# EAGLE board MainECU rev2 (EAGLE 9.2.2)
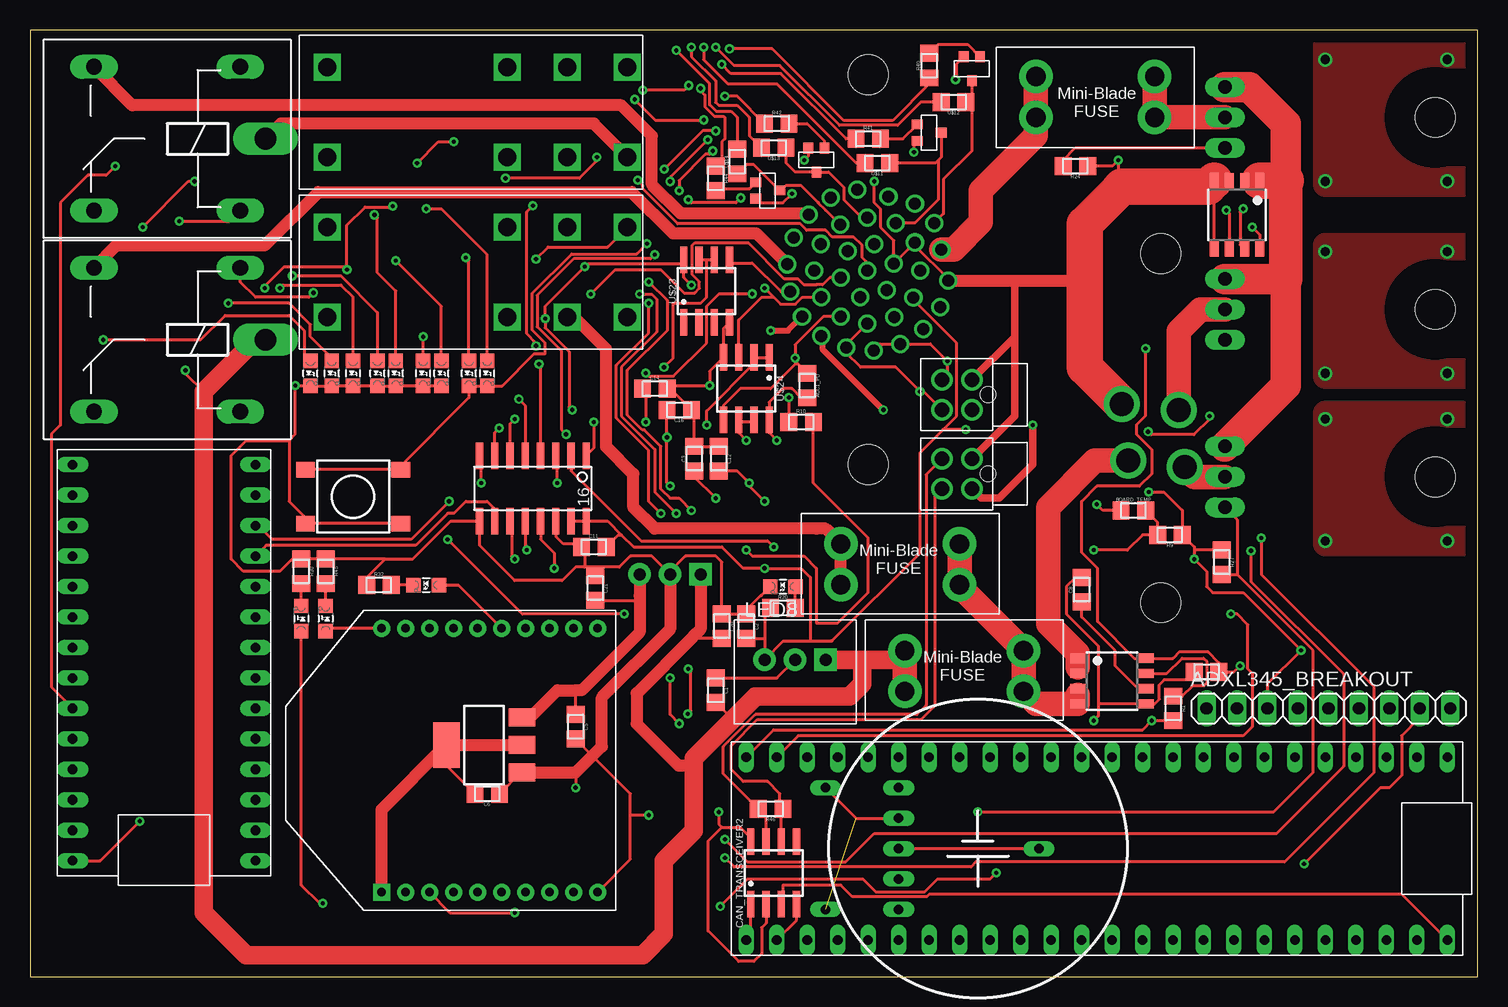
[diagram p2: board, top side]
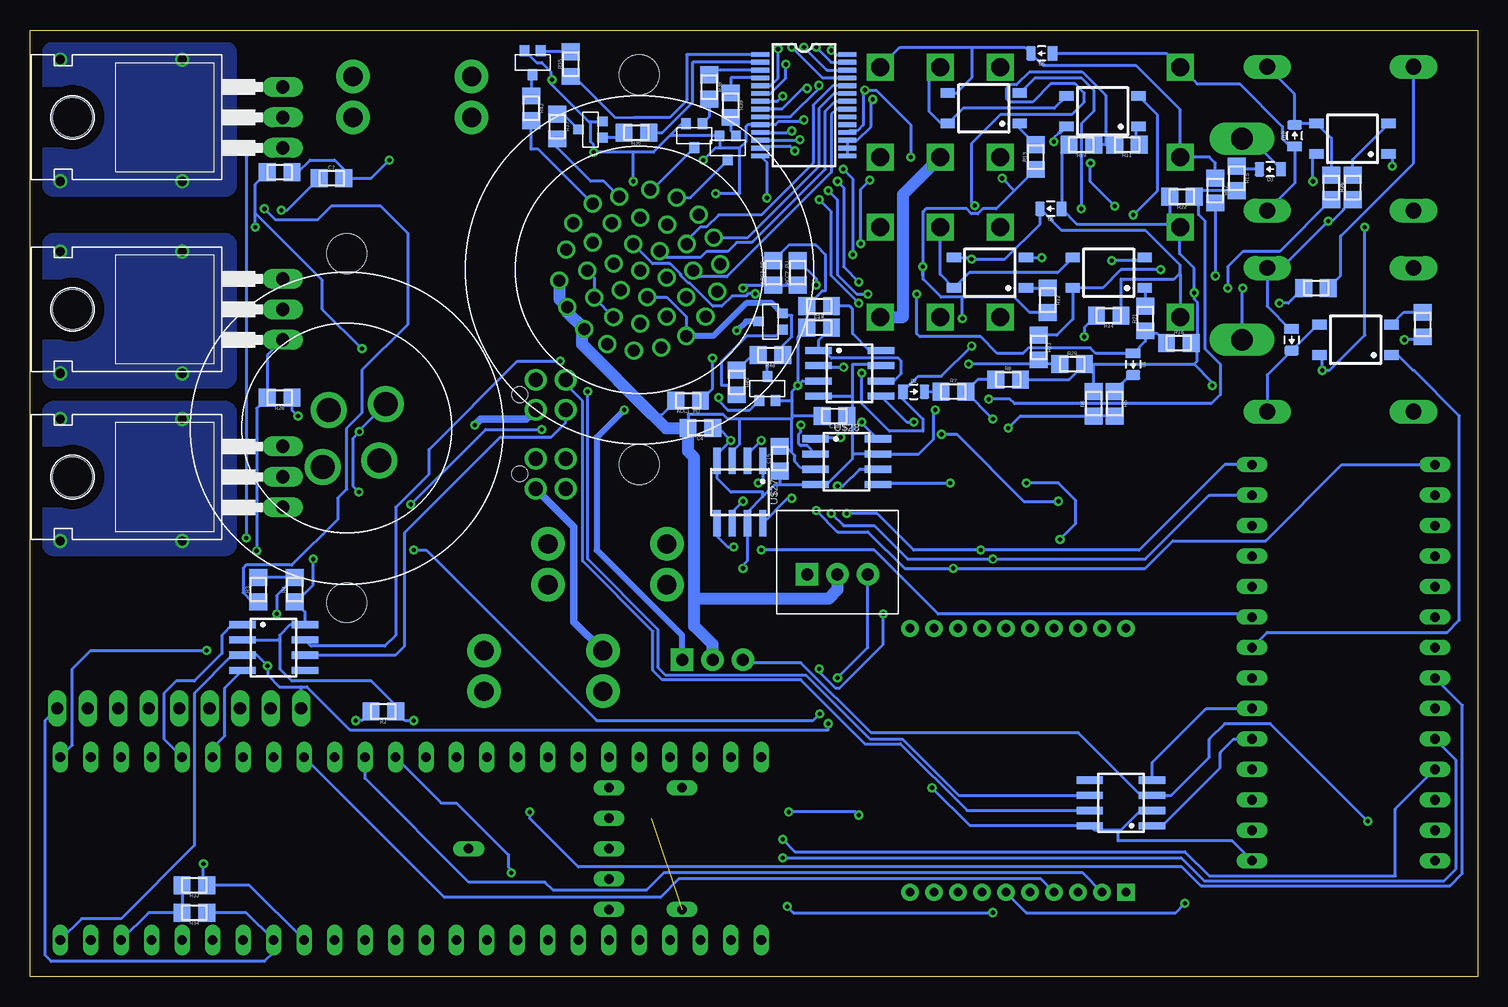
[diagram p3: board, bottom side, seen from below]

Size 120.63 x 78.92 mm. Coordinates in mm from the lower left corner, seen from the top.
Outline: 0,0 120.63,0 120.63,78.92 0,78.92 0,0
Copper layers (1*16): Top 0.035mm / dielectric 1.5mm / Bottom 0.035mm
Design rules "DRC Advanced Circuits": minimum track width 6mil, minimum drill 10mil, track to track 6mil, track to pad 6mil, pad to pad 6mil, via to via 6mil, smd to smd 6mil, copper to edge 40mil, drill to drill 6mil, minimum pad ring 10mil, minimum via ring 8mil, stop-mask expansion 4mil, vias tented up to drill 0mil, thermal gap 10mil

## Footprints (pad centres in the part's own frame; a part is rotated, then mirrored left to right if it is on the bottom)
MINI-BLADE_FUSE_HOLDER = drill 1.613 pad 2.794: L1 0,3.404; L2 0,0; R1 9.906,3.404; R2 9.906,0
0805 = smd 1.4 x 1.5: 1 -1.025,0; 2 1.025,0
1X09 = drill 1.016 long: 1 -8.89,0; 2 -6.35,0; 3 -3.81,0; 4 -1.27,0; 5 1.27,0; 6 3.81,0; 7 6.35,0; 8 8.89,0; 9 11.43,0
SOP04 = smd 0.8 x 1.2: 1 -1.27,-3; 2 1.27,-3; 3 1.27,3; 4 -1.27,3
SOIC-08 = smd 0.6 x 2.2: 1 -1.905,-2.6; 2 -0.635,-2.6; 3 0.635,-2.6; 4 1.905,-2.6; 5 1.905,2.6; 6 0.635,2.6; 7 -0.635,2.6; 8 -1.905,2.6
0805_D = smd 0.8 x 1.2: A -0.9,0; C 0.9,0
G2RL-2 = drill 1.5 square: 2 10.008,0; 3 5.004,0; 4 0,0; 5 0,7.493; 6 5.004,7.493; 7 10.008,7.493; COIL+ 25.019,0; COIL- 25.019,7.493
LED-805 = smd 1.2 x 1.2: A 0,-1.05; C 0,1.05
SOT23 = smd 0.8 x 0.9: 1 -0.675,-1; 2 0.675,-1; 3 0,1
OKI-78SR = drill 1 pad 1.88 square: 1 -2.54,0 | drill 1 pad 1.88: 2 0,0; 3 2.54,0
SOT223 = smd 1.5 x 2.235: 1 -2.3,-3.15; 2 0,-3.15; 3 2.3,-3.15 | smd 3.8 x 2.2: 4 0,3.15
TACTILE_SWITCH_SMD_6.2MM_TALL = smd 1.55 x 1.3: A1 -3.975,-2.25; A2 3.975,-2.25; B1 -3.975,2.25; B2 3.975,2.25
ZF112 = drill 1.321 long: 1 4.064,14.884; 2 4.064,2.896; O 16.256,14.884; S 16.256,2.896 | drill 1.803 long: P 1.956,8.89
TEENSY_3.2_SIMPLE = drill 0.8 long: 3.3V 16.51,29.21; A0 16.51,3.81; A1 16.51,6.35; A2 16.51,8.89; A3 16.51,11.43; A4 16.51,13.97; A5 16.51,16.51; A6 16.51,19.05; A7 16.51,21.59; A8 16.51,24.13; A9 16.51,26.67; AGND 16.51,31.75; D0(RX1) 1.27,31.75; D1(TX1) 1.27,29.21; D2 1.27,26.67; D3(CANTX) 1.27,24.13; D4(CANRX) 1.27,21.59; D5 1.27,19.05; D6 1.27,16.51; D7(RX3) 1.27,13.97; D8(TX3) 1.27,11.43; D9(RX2) 1.27,8.89; D10(TX2) 1.27,6.35; D11 1.27,3.81; D12 1.27,1.27; D13 16.51,1.27; GND 1.27,34.29; VIN 16.51,34.29
TEENSY_3.5_EXT = drill 0.8 long: 3.3V 16.51,54.61; 3.3V_1 1.27,24.13; 3.3V_2 6.35,13.97; A0 16.51,29.21; A1 16.51,31.75; A2 16.51,34.29; A3 16.51,36.83; A4 16.51,39.37; A5 16.51,41.91; A6 16.51,44.45; A7 16.51,46.99; A8 16.51,49.53; A9 16.51,52.07; A12 1.27,3.81; A13 1.27,1.27; A14 16.51,1.27; A15 16.51,3.81; A16 16.51,6.35; A17 16.51,8.89; A18 16.51,11.43; A19 16.51,13.97; A20 16.51,16.51; A21 16.51,19.05; A22 16.51,21.59; AGND 16.51,57.15; D0(RX1) 1.27,57.15; D1(TX1) 1.27,54.61; D2 1.27,52.07; D3(CANTX) 1.27,49.53; D4(CANRX) 1.27,46.99; D5 1.27,44.45; D6 1.27,41.91; D7(RX3) 1.27,39.37; D8(TX3) 1.27,36.83; D9(RX2) 1.27,34.29; D10(TX2) 1.27,31.75; D11 1.27,29.21; D12 1.27,26.67; D13 16.51,26.67; D24 1.27,21.59; D25 1.27,19.05; D26 1.27,16.51; D27 1.27,13.97; D28 1.27,11.43; D29 1.27,8.89; D30 1.27,6.35; GND 1.27,59.69; GND_1 16.51,24.13; GND_2 8.89,13.97; PROG 11.43,13.97; RST 13.97,13.97; VBAT 3.81,13.97; VIN 16.51,59.69
XBEE = drill 0.7 pad 1.422 square: 1 -11,5.5 | drill 0.7 pad 1.422: 2 -11,3.5; 3 -11,1.5; 4 -11,-0.5; 5 -11,-2.5; 6 -11,-4.5; 7 -11,-6.5; 8 -11,-8.5; 9 -11,-10.5; 10 -11,-12.5; 11 11,-12.5; 12 11,-10.5; 13 11,-8.5; 14 11,-6.5; 15 11,-4.5; 16 11,-2.5; 17 11,-0.5; 18 11,1.5; 19 11,3.5; 20 11,5.5
TO-220-H-HOLE = drill 1.118 long: 1 -2.54,-6.35; 2 0,-6.35; 3 2.54,-6.35 | hole 3.302: 0,11.176
SOP8 = smd 0.76 x 1.27: 1 -1.905,-2.86; 2 -0.635,-2.86; 3 0.635,-2.86; 4 1.905,-2.86; 5 1.905,2.86; 6 0.635,2.86; 7 -0.635,2.86; 8 -1.905,2.86
CR-2450/G1AN = drill 0.8 long: +_0 -5.08,12.7; +_1 5.08,12.7; - 0,-5.08
SSOP28 = smd 0.4 x 1.5: 1 -4.225,-3.625; 2 -3.575,-3.625; 3 -2.925,-3.625; 4 -2.275,-3.625; 5 -1.625,-3.625; 6 -0.975,-3.625; 7 -0.325,-3.625; 8 0.325,-3.625; 9 0.975,-3.625; 10 1.625,-3.625; 11 2.275,-3.625; 12 2.925,-3.625; 13 3.575,-3.625; 14 4.225,-3.625; 15 4.225,3.625; 16 3.575,3.625; 17 2.925,3.625; 18 2.275,3.625; 19 1.625,3.625; 20 0.975,3.625; 21 0.325,3.625; 22 -0.325,3.625; 23 -0.975,3.625; 24 -1.625,3.625; 25 -2.275,3.625; 26 -2.925,3.625; 27 -3.575,3.625; 28 -4.225,3.625
SOIC-16 = smd 0.6 x 2.2: 1 -4.445,-2.794; 2 -3.175,-2.794; 3 -1.905,-2.794; 4 -0.635,-2.794; 5 0.635,-2.794; 6 1.905,-2.794; 7 3.175,-2.794; 8 4.445,-2.794; 9 4.445,2.667; 10 3.175,2.667; 11 1.905,2.667; 12 0.635,2.667; 13 -0.635,2.667; 14 -1.905,2.667; 15 -3.175,2.667; 16 -4.445,2.667
AUTOSPORT_14-35 = drill 1: P$1 1.143,6.655; P$2 3.124,5.512; P$3 5.359,4.064; P$4 6.452,2.032; P$5 6.756,-0.254; P$6 6.274,-2.489; P$7 5.08,-4.445; P$8 3.302,-5.893; P$9 1.143,-6.655; P$10 -1.143,-6.655; P$11 -3.302,-5.893; P$12 -5.08,-4.445; P$13 -6.274,-2.489; P$14 -6.756,-0.254; P$15 -6.452,2.032; P$16 -5.359,4.064; P$17 -3.124,5.512; P$18 -1.143,6.655; P$19 1.143,4.369; P$20 3.124,3.023; P$21 4.318,1.016; P$22 4.318,-1.27; P$23 3.124,-3.226; P$24 1.143,-4.369; P$25 -1.143,-4.369; P$26 -3.124,-3.226; P$27 -4.318,-1.27; P$28 -4.318,1.016; P$29 -3.124,3.023; P$30 -1.143,4.369; P$31 1.143,1.88; P$32 2.286,-0.102; P$33 1.143,-2.083; P$34 -1.143,-2.083; P$35 -2.286,-0.102; P$36 -1.143,1.88; P$37 0,-0.102 | hole 3.3: -11.491,-11.491; 11.491,11.491
AUTOSPORT_12-04 = drill 2: P$1 0,3.81; P$2 3.708,0.889; P$3 0,-2.108; P$4 -3.708,0.889 | hole 3.3: -10.288,-10.288; 10.288,10.288
NANO-FIT_VERTICAL-4 = drill 1.2: P$1 -1.25,0; P$2 1.25,0; P$3 -1.25,2.5; P$4 1.25,2.5 | hole 1.3: 0,-1.34

## Placement (x,y rotation side)
5ABOARDFUSE  [MINI-BLADE_FUSE_HOLDER]  82.8,27.18 180 top
5AFUSE  [MINI-BLADE_FUSE_HOLDER]  83.82,71.63 0 top
5ASHUTDOWNFUSE  [MINI-BLADE_FUSE_HOLDER]  77.47,36.07 180 top
ACC1_PD  10k  [0805]  65.79,48.01 180 bottom
ACC1_PU  10k  [0805]  64.77,49.28 270 top
ACC2_PD  10k  [0805]  58.67,58.67 90 bottom
ACC2_PU  10k  [0805]  56.64,58.67 90 bottom
ADXL345_BREAKOUT  [1X09]  106.93,22.35 0 top
BMS_LATCH_SSR  CPC1002N  [SOP04]  41.15,72.39 90 bottom
BMS_SSR  CPC1002N  [SOP04]  31.24,72.14 90 bottom
BOARD_TEMP  THERMISTOR_NCP210805  [0805]  91.95,38.86 0 top
C1  10uF  [0805]  57.15,23.88 270 top
C2  10uF  [0805]  59.69,29.21 270 top
C3  47nF  [0805]  55.37,43.18 90 top
C4  .1uF  [0805]  64.77,45.72 180 bottom
C5  1uF  [0805]  45.47,20.83 270 top
C6  1uF  [0805]  38.1,15.24 180 top
C7  [0805]  95.5,66.55 0 bottom
C8  [0805]  87.63,32.26 90 top
C9  0.1uF  [0805]  98.04,25.4 180 top
C10  0.1uF  [0805]  99.82,67.06 0 bottom
C11  1uF  [0805]  46.99,35.81 0 top
C12  .1uF  [0805]  57.4,43.18 270 top
C14  47nF  [0805]  52.07,49.02 0 top
C15  .1uF  [0805]  58.17,43.18 90 bottom
C16  .1uF  [0805]  54.1,47.24 180 top
C17  47nF  [0805]  54.86,55.88 180 bottom
C18  .1uF  [0805]  53.59,46.74 180 bottom
C19  .1uF  [0805]  54.86,54.1 0 bottom
C20  10uF  [0805]  57.66,29.21 270 top
C21  10uF  [0805]  47.12,32.38 270 top
CAN_TRANSCEIVER  MCP2551  [SOIC-08]  100.33,27.43 270 bottom
CAN_TRANSCEIVER1  MCP2551  [SOIC-08]  29.72,14.48 90 bottom
CAN_TRANSCEIVER2  MCP2551  [SOIC-08]  61.98,8.64 0 top
D1  DIODE0805  [0805_D]  28.7,51.05 270 bottom
D2  DIODE0805  [0805_D]  46.99,48.77 0 bottom
D3  DIODE0805  [0805_D]  17.27,67.31 180 bottom
D4  DIODE0805  [0805_D]  15.49,53.09 270 bottom
D5  DIODE0805  [0805_D]  36.32,76.96 180 bottom
D6  DIODE0805  [0805_D]  35.56,64.01 180 bottom
D10  DIODE0805  [0805_D]  15.24,70.1 90 bottom
IMD_LATCH_SSR  CPC1002N  [SOP04]  40.64,58.67 90 bottom
IMD_SHUTDOWN  G2RL-2-DC12  [G2RL-2]  49.78,62.48 180 top
IMD_SHUTDOWN1  G2RL-2-DC12  [G2RL-2]  49.78,75.82 180 top
IMD_SSR  CPC1002N  [SOP04]  30.73,58.67 90 bottom
INVERTER_SSR  CPC1002N  [SOP04]  10.16,53.09 90 bottom
LED1  White  [LED-805]  36.58,50.29 180 top
LED2  White  [LED-805]  38.1,50.29 180 top
LED3  Green  [LED-805]  30.48,50.29 180 top
LED5  Yellow  [LED-805]  32.77,50.29 180 top
LED6  Red  [LED-805]  23.37,50.29 180 top
LED7  Green  [LED-805]  28.96,50.29 180 top
LED8  Purple  [LED-805]  62.74,32.51 90 top
LED9  Yellow  [LED-805]  34.29,50.29 180 top
LED10  Red  [LED-805]  33.02,32.64 90 top
LED11  Green  [LED-805]  22.61,29.84 0 top
LED14  Blue  [LED-805]  24.64,29.84 0 top
LED17  RED  [LED-805]  26.92,50.29 180 top
LED18  RED  [LED-805]  25.15,50.29 180 top
Q1  MMBT3904LT3G  [SOT23]  78.74,76.2 180 bottom
Q2  MMBT3904LT3G  [SOT23]  73.91,70.61 90 bottom
Q3  MMBT3904LT3G  [SOT23]  65.28,70.1 180 bottom
Q4  MMBT3904LT3G  [SOT23]  62.48,69.09 180 bottom
Q5  MMBT3904LT3G  [SOT23]  78.49,75.69 180 top
Q6  MMBT3904LT3G  [SOT23]  74.93,70.36 270 top
Q7  MMBT3904LT3G  [SOT23]  65.53,68.07 180 top
Q8  MMBT3904LT3G  [SOT23]  61.47,65.53 270 top
Q10  MMBT3904LT3G  [SOT23]  59.18,49.02 0 bottom
R1  1K  [0805]  95.25,22.35 270 top
R2  2K  [0805]  91.19,22.1 180 bottom
R3  1K  [0805]  101.6,32.26 90 bottom
R4  2K  [0805]  98.55,32.26 90 bottom
R5  43k  [0805]  30.23,47.75 270 bottom
R6  12k  [0805]  32,47.75 90 bottom
R7  43k  [0805]  43.69,48.77 0 bottom
R8  12k  [0805]  39.12,49.78 0 bottom
R9  10k  [0805]  95,36.83 180 top
R10  2.2k  [0805]  64.26,46.23 0 top
R11  150  [0805]  29.21,69.34 180 bottom
R12  33  [0805]  35.81,56.39 270 bottom
R13  33  [0805]  36.83,68.33 90 bottom
R14  2k  [0805]  30.73,55.12 180 bottom
R15  43k  [0805]  20.07,66.55 270 bottom
R16  43  [0805]  4.57,54.36 270 bottom
R17  20k  [0805]  21.84,65.53 270 bottom
R18  2.2k  [0805]  24.89,52.83 0 bottom
R19  10k  [0805]  33.02,69.34 180 bottom
R20  270  [0805]  62.74,30.73 0 top
R21  2k  [0805]  27.69,54.86 90 bottom
R22  12k  [0805]  24.64,65.02 180 bottom
R23  43k  [0805]  36.58,52.45 270 bottom
R24  10k  [0805]  87.12,67.56 180 top
R25  330  [0805]  10.41,65.79 90 bottom
R26  1.2K  [0805]  12.19,65.79 270 bottom
R27  10k  [0805]  99.31,34.54 270 top
R28  10k  [0805]  99.82,48.26 180 bottom
R29  12k  [0805]  33.78,51.05 0 bottom
R30  33  [0805]  22.61,33.78 270 top
R31  6.8k  [0805]  13.46,57.4 180 bottom
R32  1.2k  [0805]  29.08,32.64 0 top
R33  4.7k  [0805]  106.93,7.62 180 bottom
R34  4.7k  [0805]  106.93,5.33 180 bottom
R35  2.2k  [0805]  75.56,76.07 90 bottom
R36  2.2k  [0805]  70.1,70.36 180 bottom
R37  0  [0805]  76.71,70.87 270 bottom
R38  2.2k  [0805]  64.01,74.17 270 bottom
R39  2.2k  [0805]  62.23,72.64 270 bottom
R40  2.2k  [0805]  74.93,75.95 90 top
R41  2.2k  [0805]  69.85,69.85 0 top
R42  2.2k  [0805]  62.23,71.12 0 top
R43  0  [0805]  78.87,72.39 270 bottom
R44  2.2k  [0805]  57.15,66.55 270 top
R45  0  [0805]  24.64,33.78 270 top
R46  120  [0805]  61.72,13.97 180 top
R48  10k  [0805]  58.93,51.82 180 bottom
R49  1.2k  [0805]  61.72,49.53 270 bottom
REG  5V  [OKI-78SR]  63.75,26.42 180 top
REG1  TLV1117LV33  [SOT223]  37.85,19.3 90 top
REG3  5V  [OKI-78SR]  53.34,33.53 0 bottom
S1  [TACTILE_SWITCH_SMD_6.2MM_TALL]  26.92,40.01 180 top
SOFTWARE_SHUTOFF  G5LE  [ZF112]  21.59,78.74 180 top
U$1  TEENSY_3.2_SIMPLE  [TEENSY_3.2_SIMPLE]  20.07,43.94 180 top
U$2  TEENSY_3.5_EXT  [TEENSY_3.5_EXT]  58.42,19.56 270 top
U$3  XBEE  [XBEE]  34.8,18.03 90 top
U$4  N-CHANNEL_MOSFET_FQP30N06L  [TO-220-H-HOLE]  105.92,55.63 90 bottom
U$5  CPC1002N  [SOP04]  10.41,69.85 90 bottom
U$6  N-CHANNEL_MOSFET_FQP30N06L  [TO-220-H-HOLE]  105.92,41.66 90 bottom
U$7  N-CHANNEL_MOSFET_FQP30N06L  [TO-220-H-HOLE]  105.92,71.63 90 bottom
U$8  G5LE  [ZF112]  21.59,61.98 180 top
U$9  ACS715_CURRENT_SENSOR  [SOP8]  90.17,24.64 270 top
U$10  ACS715_CURRENT_SENSOR  [SOP8]  100.58,63.5 180 top
U$11  JUMPER  [0805]  70.61,67.82 180 top
U$12  JUMPER  [0805]  76.96,72.9 180 top
U$13  JUMPER  [0805]  61.98,69.09 180 top
U$14  JUMPER  [0805]  58.93,67.94 90 top
U$15  SMMBT2907ALT1G  [SOT23]  58.93,54.61 90 bottom
U$16  CR-2450/G1AN  [CR-2450/G1AN]  78.99,10.67 90 top
U$17  MCP23S17SSOP28  [SSOP28]  56.13,72.64 270 bottom
U$18  MCP3208SOIC  [SOIC-16]  41.91,40.64 180 top
U$23  MCP6002SOIC  [SOIC-08]  56.39,57.15 0 top
U$24  MCP6002SOIC  [SOIC-08]  59.69,49.02 180 top
U$26  [SOIC-08]  52.32,50.29 270 bottom
U$27  [SOIC-08]  61.47,40.39 180 bottom
U$28  [SOIC-08]  52.58,42.93 270 bottom
X1  CONNECTOR-37  [AUTOSPORT_14-35]  69.85,58.93 45 bottom
X2  CONNECTOR-4AUTOSPORT  [AUTOSPORT_12-04]  94.23,45.72 225 bottom
X3  CONNECTOR-4NANO-FIT-VERTICAL-4  [NANO-FIT_VERTICAL-4]  78.49,48.51 90 top
X4  CONNECTOR-4NANO-FIT-VERTICAL-4  [NANO-FIT_VERTICAL-4]  78.49,41.91 90 top

## Tracks (layer width: path | path; a pad name or v marks a point on that pad's centre or on a via)
3.3V
  Bottom 0.254: U$2.3.3V 110.74,5.33 R34.2 R33.2
12VIN
  Top 0.508: 87.31,25.78 U$9.2
  Top 2.032: X2.P$1 88.75,43.03 84.84,39.12 84.84,29.4 87.31,26.92 U$9.1 87.31,25.78
12VSUPPLY_READ  (via drill 0.35)
  Top 0.254: U$18.4 42.55,50.93 v42.42,51.05
  Bottom 0.254: R29.1 36.2,51.05 R23.2 36.95,51.05 v42.42,51.05
12VUNFUSED
  Top 0.508: 87.31,23.5 U$9.3
  Top 2.032: 5ASHUTDOWNFUSE.L2 5ASHUTDOWNFUSE.L1 77.47,32.51 79.76,30.23 5ABOARDFUSE.L2 5ABOARDFUSE.L1 83.84,22.73 U$9.4 87.31,23.5
+5V  (via drill 0.35, 0.35 pad 0.55)
  Top 0.254: 65.02,27.94 66.7,27.94 66.73,27.96 66.83,27.96 74.17,35.31 74.17,43.69 76.1,45.62 | 65.02,27.94 62.74,27.94 REG.3 61.21,28.19 | U$18.15 U$18.16 48.13,37.97 49.28,36.83 | 76.1,45.62 77.22,46.74 77.22,52.83 73.62,56.43 X1.P$28 | R20.1 61.21,30.23 61.21,28.19 | C2.2 61.2,28.18 61.21,28.19 | v62.23,44.7 61.59,45.34 U$24.8 61.59,47.88 62.74,49.02 63.5,49.02 64.27,48.25 ACC1_PU.2 | 49.28,36.83 50.29,35.81 57.66,35.81 59.44,34.04 v61.21,34.04 64.26,34.04 65.02,33.27 65.02,27.94 | v51.05,73.91 54.51,73.91 v54.89,74.3 | v45.19,47.24 44.94,47.5 44.94,52.09 42.93,54.1 v42.93,54.86 42.93,55.88 v46.23,59.18 46.48,59.44 54.17,59.44 U$23.8 54.48,58.29 v55.12,57.66 | v47.24,68.33 47.2,68.28 47.2,67.97 45.77,66.55 v39.62,66.55 | BOARD_TEMP.1 89.41,38.86 v88.9,39.37 | v77.98,45.62 76.1,45.62 | C11.2 49.03,36.83 49.28,36.83 | U$1.VIN 5.84,9.65 v9.14,12.95
  Bottom 0.254: 38.6,65.53 40.12,64.01 41.23,64.01 41.64,63.6 42.18,63.6 42.59,64.01 45.97,64.01 46.2,63.78 46.2,58.42 | 42.93,56.64 38.61,56.64 37.34,55.37 35.82,55.37 R12.2 | 42.93,56.64 44.7,56.64 46.2,58.14 46.2,58.42 | v61.21,34.04 61.21,34.29 60.83,34.67 U$27.7 60.83,38.73 59.56,40.01 | 59.56,40.01 59.56,40.39 62.23,40.39 63.37,41.53 U$27.4 63.37,43.56 v62.23,44.7 63.25,45.72 C4.1 | 58.17,41.02 58.55,41.02 59.56,40.01 | 58.17,41.02 U$28.4 54.23,41.02 52.07,43.18 52.07,43.69 | U$26.4 52.07,48.39 | 52.07,48.39 52.07,51.05 49.85,51.05 U$26.7 | 52.07,46.48 52.07,48.39 | 52.07,46.48 52.31,46.48 C18.1 | 52.07,43.69 52.07,46.48 | 52.07,43.69 51.94,43.56 U$28.7 46.59,43.56 45.33,44.82 45.33,47.24 v45.19,47.24 | C15.1 58.17,41.02 | U$17.18 52.34,70.54 51.64,70.54 51.18,71 51.18,73.79 v51.05,73.91 50.12,73.91 47.24,71.03 v47.24,68.33 | U$17.9 57.26,71.67 54.89,74.04 v54.89,74.3 | v39.62,66.55 38.6,65.53 | R13.1 38.6,65.53 | ACC2_PU.2 55.12,58.17 v55.12,57.66 | v88.9,39.37 82.65,45.62 v77.98,45.62 | REG.3 60.96,26.16 56.39,26.16 50.55,20.32 33.27,20.32 28.07,15.11 CAN_TRANSCEIVER1.3 25.53,15.11 22.35,18.29 22.35,19.81 21.08,21.08 17.27,21.08 v9.14,12.95 | 46.2,58.42 46.23,58.45 v46.23,59.18 | v42.93,54.86 42.93,56.64 | X1.P$29 73.62,58.28 X1.P$28 X1.P$27
+12V  (via drill 0.35, 0.35 pad 0.55)
  Top 0.254: v12.95,50.55 12.95,50.29 14.48,48.77 | v9.4,62.48 13.21,66.29 v13.72,66.29 | v32.26,67.82 34.04,69.6 v35.31,69.6 | v19.56,57.4 19.56,57.57 21.17,59.18 26.42,59.18 v26.42,58.93 26.42,62.65 27.92,64.16 30.14,64.16 v30.23,64.24 | C20.2 55.38,28.18 55.24,28.32 | C1.2 58.56,21.44 58.57,21.44
  Top 0.508: X1.P$10 66.04,53.33 66.04,52.32 v71.12,47.24
  Top 0.61: v83.57,45.97 83.57,42.67 81.03,40.13 80.77,39.88 79.27,39.88 X4.P$1
  Top 1.016: REG3.1 55.88,28.96 55.24,28.32 50.55,23.62 50.55,21.08 54.03,17.59 55.19,17.59 55.31,17.72
  Top 1.524: 5ABOARDFUSE.R2 72.14,26.42 69.34,26.42 | 69.34,26.42 REG.1 | U$8.P 18.8,53.09 14.48,48.77 14.48,5.33 18.03,1.78 51.05,1.78 52.83,3.56 52.83,9.65 55.31,12.13 55.31,17.72 55.31,18.18 58.57,21.44 60.44,23.31 60.44,23.37 68.33,23.37 69.34,24.38 69.34,26.42
  Top 2.032: 5ABOARDFUSE.R2 5ABOARDFUSE.R1
  Bottom 0.254: R23.1 35.05,53.48 33.73,54.79 IMD_SSR.4 31.24,57.4 29.72,58.93 v26.42,58.93 | v13.72,66.29 13.72,68.28 U$5.4 | v30.23,64.24 32.26,66.27 v32.26,67.82 | BMS_SSR.4 34.74,70.37 34.86,70.37 35.31,69.93 v35.31,69.6 | INVERTER_SSR.4 12.95,51.61 v12.95,50.55 12.32,50.55 9.4,53.47 v9.4,62.48 | R48.1 57.9,52.59 57.15,53.34 57.15,55.12 57.76,55.12 U$15.2 | v19.56,57.4 19.63,57.33 U$8.P | X1.P$34 67.57,56.65 65.95,55.03 X1.P$10
  Bottom 0.508: REG.1 66.29,28.45 73.41,35.56 73.41,44.96 v71.12,47.24 | U$15.2 58.78,56.13 60.96,56.13 63.68,53.41 X1.P$10
  Bottom 0.61: X4.P$1 75.3,37.48 75.3,29.58 5ABOARDFUSE.R2 | v83.57,45.97 83.06,46.48 79.27,46.48 X3.P$1
BMS_COIL_PWR
  Bottom 0.254: BMS_LATCH_SSR.3 43.43,73.66 42.16,74.93 42.16,77.47 | IMD_SHUTDOWN1.4 48.13,77.47 42.16,77.47 | 42.16,77.47 37.73,77.47 D5.C 36.21,75.95 28.45,75.95 24.77,72.26 IMD_SHUTDOWN1.COIL- 22.34,68.33 21.84,67.83 R17.1
BMS_OK  (via drill 0.35, 0.35 pad 0.55)
  Top 0.254: v41.91,64.26 41.4,63.75 41.4,53.59 42.16,52.83 v42.16,52.58 | v51.31,50.3 51.56,50.05 53.61,50.05 56.39,52.83 56.39,55.88 57.43,56.92 v60.2,56.92
  Bottom 0.254: v42.16,52.58 44.69,50.05 46.61,50.05 D2.A 47.89,48.14 46.23,46.48 46.23,45.47 49.02,45.47 51.31,47.75 v51.31,50.3 | 30.99,69.34 30.99,73.47 32.95,75.44 37.34,75.44 38.44,74.34 38.99,74.34 39.24,74.09 39.24,73.15 38.99,72.9 37.08,72.9 35.56,74.42 33.53,74.42 32.77,73.66 32.77,72.9 33.78,71.88 39.75,71.88 42.16,69.47 42.16,64.52 v41.91,64.26 | 30.99,69.34 R19.1 | R11.2 30.99,69.34 | v60.2,56.92 60.77,56.92 60.94,56.75 62.13,56.75 62.99,55.88 63.72,55.88 65.67,57.82 65.79,57.82 66.39,58.43 66.39,58.55 67.28,59.44 68.74,59.44 X1.P$31
BMS_OK_READ  (via drill 0.35 pad 0.55)
  Top 0.254: U$18.6 40.01,46.1 v40.39,46.48
  Bottom 0.254: R8.1 41.65,49.78 R7.2 v40.39,46.48
BMS_PWR_STEP
  Bottom 0.254: BMS_SSR.3 35.26,72.39 42.88,72.39 BMS_LATCH_SSR.4 44.7,71.12 45.72,72.14 45.72,74.88 IMD_SHUTDOWN1.3
BRAKE_LIGHT  (via drill 0.35)
  Top 0.508: v61.72,53.85 63.15,53.85 X1.P$9
  Bottom 0.508: U$15.3 60.96,54.61 v61.72,53.85
BRAKE_LIGHT_CTRL  (via drill 0.35)
  Top 0.254: v59.69,35.56 60.2,35.05 64.52,35.05 65.53,34.04 65.53,29.46 67.31,29.46 69.85,32 69.85,36.58 65.28,41.15 65.28,46.22 R10.2
  Bottom 0.254: U$1.D7(RX3) 19.05,30.23 44.96,30.23 50.29,35.56 v59.69,35.56
CANH  (via drill 0.35)
  Top 0.254: X3.P$4 76.45,50.23 v76.45,51.31 75.03,52.73 X1.P$13 70.84,52.73 X1.P$12
  Bottom 0.254: CAN_TRANSCEIVER1.7 42.55,13.84 48.11,19.41 51.05,19.41 56.39,24.74 67.94,24.74 68.73,25.53 68.73,28.79 74.57,34.63 74.57,47.97 75.99,49.38 X3.P$4 | v76.45,51.31 80.01,51.31 87.38,43.94 87.38,41.91 90.17,39.12 90.17,28.45 91.06,27.56 97.22,27.56 CAN_TRANSCEIVER.7
CANL  (via drill 0.35)
  Top 0.254: X3.P$3 74.48,48.77 v74.17,48.77 72.14,50.8 69.22,50.8 68.02,52 X1.P$11 68.02,52.68 X1.P$26
  Bottom 0.254: CAN_TRANSCEIVER.6 90.17,26.8 89.41,27.56 89.41,37.02 81.47,44.96 77.22,44.96 75.99,46.19 X3.P$3 | CAN_TRANSCEIVER1.6 43.24,15.11 47.94,19.81 50.63,19.81 55.97,25.15 67.69,25.15 68.33,25.78 68.33,28.96 74.17,34.8 v74.17,48.77
CHIP_SELECT1
  Top 0.254: U$1.D9(RX2) 19.68,35.94 32.13,35.94 34.8,38.61 35.31,38.61 36.32,39.62 38.1,39.62 38.73,38.99 U$18.10
CHIP_SELECT2  (via drill 0.35)
  Top 0.254: v57.15,70.5 56.05,70.5 v52.85,67.31 | v52.07,60.2 51.71,59.84 45.3,59.84 42.27,56.81 42.27,54.19 44.27,52.18 44.27,45.61 v44.67,45.21 | v34.92,39.62 31.75,36.45 20.19,36.45 19.05,37.59 U$1.D10(TX2)
  Bottom 0.254: U$17.11 57.54,70.37 57.4,70.5 v57.15,70.5 | v52.85,67.31 52.07,66.53 v52.07,60.2 | v44.67,45.21 43.4,45.21 37.81,39.62 v34.92,39.62
COOLINGSENSE  (via drill 0.35)
  Top 0.254: U$2.A12 64.01,20.07 101.09,20.07 101.85,20.83 101.85,25.28 101.5,25.64 101.5,29.31 100.58,30.23 v100.08,30.23
  Bottom 0.254: R3.2 100.58,33.28 R4.2 100.08,31.76 v100.08,30.23
CURRENTSENSE2
  Top 0.508: U$10.2 U$10.1
  Top 2.54: U$6.3 104.65,49.28 104.65,58.17 U$4.3 | 104.65,66.36 104.65,71.12 101.6,74.17 U$7.3
  Top 2.794: 104.65,58.17 104.65,66.36
  Top 3.048: U$10.1 104.65,66.36
DASH_CTRL1
  Bottom 0.254: U$17.1 65.91,76.87 65.91,73.03 67.31,71.62 70.25,71.62 71.89,71.63 75.3,75.05 R35.1
DASH_CTRL2
  Bottom 0.254: U$17.2 65.41,76.22 65.41,72.9 67.94,70.36 R36.1
DASH_CTRL3
  Bottom 0.254: U$17.3 63.63,75.57 R38.1
DASH_CTRL4
  Bottom 0.254: U$17.4 62.23,74.92 R39.1
DASH_CTRL5_IN  (via drill 0.35)
  Top 0.254: U$12.2 74.23,72.9 72.3,70.97 67.46,70.97 62.48,75.95 58.67,75.95 v57.15,77.47
  Bottom 0.254: U$17.25 54.6,74.92 v57.15,77.47
DASH_CTRL5_OUT  (via drill 0.35)
  Top 0.254: R40.1 74.93,74.42 71.88,71.37 67.82,71.37 61.85,77.34 v58.29,77.34
  Bottom 0.254: U$17.5 58.93,74.27 58.29,74.9 v58.29,77.34
DASH_CTRL6_IN  (via drill 0.35)
  Top 0.254: U$11.2 68.83,67.82 62.23,74.42 58.17,74.42 56.13,76.45 v56.13,77.47
  Bottom 0.254: v56.13,77.47 54.23,75.56 U$17.26
DASH_CTRL6_OUT  (via drill 0.35)
  Top 0.254: R41.1 68,69.85 62.57,75.29 58.4,75.29 v57.63,76.05
  Bottom 0.254: U$17.6 58.93,73.62 57.63,74.91 v57.63,76.05
DASH_CTRL7_IN  (via drill 0.35)
  Top 0.254: U$13.2 59.94,70.1 59.94,71.63 58.93,72.64 57.4,72.64 57.15,72.89 57.15,74.68 55.12,76.71 v55.12,77.47
  Bottom 0.254: v55.12,77.47 53.87,76.22 U$17.27
DASH_CTRL7_OUT  (via drill 0.35)
  Top 0.254: R42.1 58.92,73.41 v57.91,73.41
  Bottom 0.254: U$17.7 58.35,72.97 v57.91,73.41
DASH_CTRL8_IN  (via drill 0.35)
  Top 0.254: v53.85,77.22 56.64,74.42 56.64,72.69 57.19,72.14 58.42,72.14 58.93,71.63 U$14.2
  Bottom 0.254: v53.85,77.22 53.85,77.19 53.52,76.87 U$17.28
DASH_CTRL8_OUT  (via drill 0.35)
  Top 0.254: R44.1 57.66,68.08 57.66,69.6 57.91,69.85 57.91,71.63 57.81,71.73 57.02,71.73 56.24,72.52 56.24,73.49 55.88,73.85 v55.88,74.04
  Bottom 0.254: v55.88,74.04 56.26,74.04 57.98,72.32 U$17.8
DASH_CTRL9
  Bottom 0.254: U$17.21 53.41,72.32 53.85,71.88 53.85,67.06 62.56,58.34 64.85,58.34 X1.P$23
DASH_CTRL10
  Bottom 0.254: U$17.22 53.52,72.97 54.36,72.14 54.36,67.31 60.47,61.2 61.74,61.2 62.48,60.45 64.26,60.45 64.77,59.94 67.63,59.94 X1.P$32
DASH_CTRL11
  Bottom 0.254: U$17.23 53.63,73.62 54.86,72.39 54.86,67.56 60.82,61.6 X1.P$6
DASH_CTRL12
  Bottom 0.254: U$17.24 53.75,74.27 55.37,72.64 55.37,67.82 59.69,63.5 63.25,63.5 64.26,62.48 64.77,62.48 65.9,61.35 X1.P$22
DASH_IO1
  Bottom 0.254: R43.2 78.87,68.96 78.27,68.96 X1.P$1
DASH_IO2
  Bottom 0.254: X1.P$2 72.8,66.29 73.91,66.29 76.71,69.09 R37.2
DASH_IO3
  Bottom 0.254: Q3.3 68.79,65.59 X1.P$3
DASH_IO4
  Bottom 0.254: Q4.3 62.48,68.05 65.6,64.93 X1.P$4
DASH_IO5
  Top 0.254: Q5.3 78.49,72.9 | 78.49,72.9 78.49,68.83 76.12,66.47 76.12,63.59 X1.P$18 | U$12.1 78.49,72.9
DASH_IO6
  Top 0.254: Q6.3 75.93,68.31 75.68,68.06 | 75.68,68.06 75.44,67.82 U$11.1 | 75.68,68.06 75.68,64.75 73.75,62.83 X1.P$19
DASH_IO7
  Top 0.254: U$13.1 63,67.83 63.75,67.07 Q7.3 66.55,67.07 67.82,65.8 67.82,64.77 69.31,63.27 X1.P$20
DASH_IO8
  Top 0.254: U$14.1 59.69,67.68 60.32,67.68 Q8.3 62.57,65.53 62.97,65.94 64.28,65.94 65.69,64.52 65.69,64.5 66.3,63.89 66.32,63.89 X1.P$21
ECUSENSE  (via drill 0.35)
  Top 0.254: U$2.A13 61.98,20.57 92.71,20.57 v93.47,21.34 R1.2
  Bottom 0.254: R2.2 92.97,21.34 v93.47,21.34
FAN1-
  Top 2.032: 5AFUSE.R1 5AFUSE.R2 U$7.2
FAN1CONTROL  (via drill 0.35)
  Top 0.254: v57.91,9.91 58.67,9.14 78.42,9.14 78.83,9.55 104.55,9.55 112.01,17.02 112.01,24.13 102.62,33.53 v102.62,36.58 | U$7.1 87.12,69.09 86.1,68.06 R24.2
  Bottom 0.254: v57.91,9.91 24.7,9.91 22.77,7.98 2.79,7.98 1.78,8.99 1.78,18.03 U$1.A8 | U$7.1 101.85,69.09 102.62,68.33 v102.62,36.58
FAN2-
  Top 2.032: X2.P$3 95.72,53.81 97.54,55.63 U$4.2
FAN2CONTROL  (via drill 0.35)
  Top 0.254: v101.75,35.5 101.75,32.94 109.47,25.21 109.47,17.53 103.89,11.94 70.36,11.94 67.97,9.55 59.79,9.55 v57.91,11.43
  Bottom 0.254: v101.75,35.5 101.75,47.36 R28.2 100.85,51.81 U$4.1 | v57.91,11.43 56.9,10.41 24.38,10.41 22.35,8.38 6.86,8.38 6.86,13.97 U$1.A9
GND  (via drill 0.35, 0.35 pad 0.55)
  Top 0.254: 45.47,17 v45.47,15.75 | C6.1 40.89,17 REG1.1 | U$3.10 50.04,9.77 50.04,13.46 | 50.04,13.46 50.04,15.24 46.87,18.41 46.86,18.41 C5.2 | 29.59,34.81 R45.1 R30.1 22.6,34.8 21.84,34.8 20.83,33.78 17.78,33.78 16.76,34.8 16.76,43.43 18.03,44.7 21.59,44.7 | v12.45,62.99 16.66,62.99 SOFTWARE_SHUTOFF.1 | LED9.C LED5.C LED3.C LED7.C LED17.C LED18.C LED6.C 22.13,49.24 v22.1,49.28 22.1,45.21 21.59,44.7 | Q5.2 77.22,76.1 77.22,74.77 v77.13,74.77 | Q6.2 73.66,69.41 v73.66,68.73 | Q7.2 64.86,68.41 v64.52,68.07 | U$23.4 57.78,54.04 U$24.4 56.64,50.48 v56.64,49.28 53.35,49.28 C14.2 53.35,49.02 C16.1 55.37,47 C3.2 C12.1 | 29.59,34.81 31.88,34.81 35.04,37.97 U$18.9 37.47,35.94 40.39,33.02 44.35,33.02 45.47,34.14 46.23,34.14 | Q8.2 60.81,64.52 62.74,64.52 v63.5,65.28 | v50.39,73.12 52.1,71.42 v56.13,71.42 | 97.03,35.57 v97.03,34.8 98.04,33.78 98.04,32.51 98.55,32 101.09,32 v105.92,27.18 103.12,24.38 ADXL345_BREAKOUT.3 | v23.62,57 23.26,56.64 18.8,56.64 17.53,57.91 U$8.2 | v93.22,40.4 94.49,40.4 96.02,38.86 R9.1 97.03,35.82 97.03,35.57 | U$18.14 43.81,36.7 44.45,36.07 45.71,36.07 C11.1 46.23,35.55 46.23,34.14 | REG3.2 53.21,33.66 | 47.12,34.14 46.23,34.14 | C21.1 47.12,34.14 | 53.21,33.66 54.61,35.05 57.15,35.05 57.66,34.54 C20.1 C2.1 59.69,30.56 60.9,31.76 60.94,31.76 LED8.C | S1.B1 S1.B2 22.95,38.27 21.59,39.62 21.59,44.7 | R27.1 97.03,35.57 | R24.1 90.17,67.56 v90.68,68.07 90.68,65.53 | 47.12,34.14 49.12,34.14 50.04,35.05 51.82,35.05 53.21,33.66 | CAN_TRANSCEIVER2.2 61.34,4.45 60.96,4.06 60.96,1.91 60.33,1.27 59.05,1.27 56.52,3.81 56.52,11.3 57.66,12.45 | 57.66,12.45 59.18,12.45 60.07,11.56 CAN_TRANSCEIVER2.8
  Top 0.254: C1.1 62.23,24.89 REG.2 | 50.04,13.46 v51.56,13.46 | v57.4,13.72 57.4,12.7 57.66,12.45 | v93.17,45.42 93.43,45.17 96.98,45.17 98.3,46.48 v98.3,46.74 | X1.P$30 X1.P$36 71.99,61.36 70.87,62.48 70.87,64.01 70.36,64.52 v70.36,66.29 | X1.P$30 | X1.P$16 76.51,58.19 73.75,60.95 X1.P$30 | 89.03,22.73 U$9.5 93.73,22.73 94.11,23.11 94.11,24.32 94.52,24.73 96.35,24.73 C9.2 | U$10.5 U$10.4 | C8.2 87.13,33.28 86.36,32.51 86.36,30.23 89.03,27.56 89.03,22.73 | 89.03,22.73 89.03,21.72 v88.65,21.34 | R32.1 28.06,33.27 29.59,34.81
  Top 0.508: U$10.3 U$10.4
  Top 0.61: 82.04,53.32 X3.P$2 | 82.04,58.01 82.04,53.32 | X4.P$2 82.04,46.72 82.04,53.32
  Top 1.016: REG1.1 45.47,17 46.87,18.41 47.65,19.19 47.65,23.27 53.34,28.96 REG3.2 | X1.P$16 82.04,58.01 87.73,58.01 87.88,58.17
  Top 3.048: U$10.4 98.17,65.85 91,65.85 90.68,65.53 87.88,62.74 87.88,58.17 87.88,50.81 X2.P$4
  Bottom 0.254: v45.47,15.75 42.29,12.57 CAN_TRANSCEIVER1.8 31.94,12.19 29.97,12.19 | CAN_TRANSCEIVER1.2 28.07,13.84 29.72,12.19 29.97,12.19 | 24.83,62.55 25.02,62.74 33.39,62.74 D6.A 34.66,68.73 R19.2 | 24.83,62.55 IMD_SHUTDOWN.COIL+ 25.66,63.38 R22.2 | D5.A 25.91,76.96 IMD_SHUTDOWN1.COIL+ 23.37,74.42 19.81,74.42 16.26,70.87 16.26,69.85 15.61,69.2 D10.A 15.24,66.14 SOFTWARE_SHUTOFF.1 | 32,51.05 R29.2 34.03,49.78 R8.2 | 32,51.05 23.62,51.05 | 23.62,51.05 23.37,51.31 23.37,52.83 23.62,52.83 | R6.2 32,51.05 | 24.83,62.55 24.83,60.26 23.62,59.05 v23.62,57 23.62,56.49 23.36,56.23 23.36,53.09 23.62,52.83 | R18.2 23.62,52.83 | R25.1 11.16,64.01 11.16,63.95 12.12,62.99 v12.45,62.99 16.36,59.08 U$8.2 17.53,55.88 15.63,53.99 D4.A | v22.1,49.28 22.1,49.53 23.62,51.05 | Q1.2 78.42,76.2 77.98,76.2 77.22,75.44 77.22,74.68 | 77.22,74.68 77.22,74.42 74.08,71.29 73.91,71.29 | 73.91,71.29 Q2.2 | 63.16,69.09 Q4.2 67.33,70.09 | 61.47,69.09 60.96,69.6 60.96,70.87 60.81,71.02 U$17.10 58.52,71.02 58.28,71.26 56.29,71.26 v56.13,71.42 | 67.33,70.09 68.68,68.73 70.36,68.73 | 73.91,71.29 73.91,69.6 73.66,69.34 v73.66,68.73 70.36,68.73 | Q3.2 66.31,71.1 67.33,70.09 | 61.47,69.09 61.47,65.28 v63.5,65.28 | v64.52,68.07 63.5,69.09 63.16,69.09 | U$26.3 56.26,49.66 v56.64,49.28 | v56.64,49.28 57.15,48.77 57.15,48.01 | 57.15,48.01 57.15,46.74 | 57.15,46.48 61.47,46.48 | v56.64,49.28 56.64,53.35 C19.1 C17.2 54.87,56.9 54.86,56.9 54.61,57.15 54.36,57.15 54.36,60.2 55.12,60.96 57.41,60.96 ACC2_PD.2 | 57.15,46.74 57.15,46.48 | C18.2 57.15,46.74 | U$28.3 55.3,42.42 56.39,42.42 56.9,42.93 56.9,43.43 57.15,43.69 | 57.15,43.69 57.67,44.2 C15.2
  Bottom 0.254: 57.15,43.69 57.15,46.48 | 63.16,69.09 61.47,69.09 | v50.39,73.12 50.55,72.97 50.55,70.87 51.69,69.72 U$17.17 U$17.16 U$17.15 | 61.47,46.48 62.48,46.48 62.87,46.86 65.8,46.86 C4.2 | Q10.2 57.17,48.02 57.15,48.01 | C10.2 98.3,67.06 97.28,68.07 95.25,68.07 94.48,67.3 C7.2 92.2,66.55 v90.68,68.07 | v77.13,74.77 77.22,74.68 | 61.47,46.48 61.47,44.4 62.1,43.77 U$27.3 | U$1.GND 20.45,11.3 29.97,11.3 29.97,12.19 | v93.22,40.4 93.73,40.91 93.73,44.87 v93.17,45.42 93.17,45.52 X2.P$4 | R28.1 98.8,47.23 v98.3,46.74 | v51.56,13.46 51.82,13.72 v57.4,13.72 | ACC1_PD.2 67.99,46.83 68.74,46.83 | X1.P$14 74.63,54.15 | X1.P$15 75.94,55.89 | v70.36,66.29 70.36,68.73 | 99.82,27.94 99.82,28.45 98.93,29.34 CAN_TRANSCEIVER.8 97.73,30.41 R4.1 98.46,31.23 97.03,32.67 v97.03,34.8 | 99.82,27.94 99.82,25.65 98.81,24.64 92.2,24.64 90.16,22.6 R2.1 89.4,21.34 v88.65,21.34 | CAN_TRANSCEIVER.2 99.95,28.07 99.82,27.94 | U$2.GND 117.09,19.3 117.09,25.65 115.57,27.18 v105.92,27.18
  Bottom 1.016: 65.28,31.24 65.28,29.23 63.75,27.71 REG.2 | 65.28,31.24 65.28,43.26 65.8,43.77 C4.2 67.63,45.72 68.74,46.83 74.63,52.71 74.63,54.15 | REG3.2 53.34,32.26 54.1,31.5 65.02,31.5 65.28,31.24 | X1.P$14 75.94,55.46 75.94,55.89 76.51,56.47 X1.P$16
HEATSINK_FAN1  (via drill 0.76)
  other vias: 107.95,66.29 107.95,76.45 118.11,76.45 118.11,66.29
  pour Bottom: 104.39,76.96 118.62,76.96 118.62,66.04 104.39,66.04
  pour Top: 107.95,78.99 119.38,78.99 119.38,66.04 107.95,66.04
HEATSINK_FAN2  (via drill 0.76)
  other vias: 107.95,60.45 118.11,60.45 118.11,50.29 107.95,50.29
  pour Bottom: 104.39,60.96 118.62,60.96 118.62,50.04 104.39,50.04
  pour Top: 107.95,60.96 119.89,60.96 119.89,50.04 107.95,50.04
HEATSINK_PUMP1  (via drill 0.76)
  other vias: 107.95,46.48 118.11,46.48 118.11,36.32 107.95,36.32
  pour Bottom: 104.39,46.99 118.62,46.99 118.62,36.07 104.39,36.07
  pour Top: 107.95,46.99 119.38,46.99 119.38,36.07 107.95,36.07
IMD_COIL_PWR  (via drill 0.35)
  Top 0.254: IMD_SHUTDOWN.4 48.13,60.83 43.18,60.83 v42.16,59.82
  Bottom 0.254: 24.77,58.55 IMD_SHUTDOWN.COIL- | R14.1 29.71,58.17 25.27,58.17 24.83,58.61 24.77,58.55 | 24.77,58.55 24.77,59.31 27.69,62.23 34.68,62.23 D6.C 36.46,62.74 39.38,59.82 v42.16,59.82 42.29,59.94 IMD_LATCH_SSR.3
IMD_PWR_STEP
  Bottom 0.254: IMD_SSR.3 35,58.67 42.37,58.67 IMD_LATCH_SSR.4 44.78,58.54 IMD_SHUTDOWN.3
INVERTER_CTRL
  Bottom 0.254: INVERTER_SSR.1 6.65,51.82 5.38,50.55 5.33,50.55 1.52,46.74 1.52,29.72 2.54,28.7 17.53,28.7 U$1.D6
INVERTER_SUPPLY
  Top 1.016: U$8.S 7.21,60.96 19.56,60.96 24,65.41 50.16,65.41 53.59,61.98 60.52,61.98 X1.P$7
LATCH_EXT_BUTTON  (via drill 0.35)
  Top 0.254: S1.A2 S1.A1 30.9,42.58 36.58,48.26 LED1.C LED2.C 39.34,49.24 42.01,51.92 42.93,51.92 42.93,52.83 41.86,53.9 41.86,56.98 45.13,60.25 50.55,60.25 v51.41,61.11 | v50.65,66.39 51.03,66.01 51.03,65.71 53.98,62.76 64.19,62.76 64.73,62.23 66.29,62.23 66.86,61.67 68.63,61.67 69.34,60.96 69.34,59.95 69.78,59.51 X1.P$37
  Bottom 0.254: v51.41,61.11 51.41,65.63 v50.65,66.39
MISO_TEENSY  (via drill 0.35)
  Top 0.254: U$18.12 41.27,35.69 v41.4,35.56 | v59.22,64.92 58.82,64.52 55.12,64.52 v54.86,64.77 | v52.58,38.61 51.56,39.62 51.56,43.88 48.87,46.57 48.87,50.97 51.56,53.66 v51.56,56.13
  Bottom 0.254: U$1.D12 21.08,42.67 28.19,35.56 v41.4,35.56 46.99,35.56 50.04,38.61 v52.58,38.61 | U$17.14 59.22,67.88 v59.22,64.92 | v51.56,56.13 53.85,58.42 53.85,63.75 v54.86,64.77
MOSI_TEENSY  (via drill 0.35)
  Top 0.254: U$18.11 40.13,37.85 40.13,35.05 v40.39,34.8 | v56.9,68.83 56.61,68.55 56.28,68.55 54.1,66.37 v54.1,65.53 | v53.85,38.61 52.07,40.39 52.07,43.94 49.28,46.74 49.28,50.8 52.22,53.74 52.22,56.49 51.82,56.9 v50.8,56.9
  Bottom 0.254: U$1.D11 22.35,40.13 27.69,34.8 v40.39,34.8 47.5,34.8 50.29,37.59 52.83,37.59 v53.85,38.61 | U$17.13 59.59,69.24 57.3,69.24 v56.9,68.83 | v50.8,56.9 51.73,56.9 53.34,58.51 53.34,64.77 v54.1,65.53
N$1
  Top 2.032: 5AFUSE.L1 5AFUSE.L2 83.82,70.1 79.25,65.53 79.25,62.89 76.97,60.62 X1.P$17
N$2  (via drill 0.35 pad 0.55)
  Top 0.254: LED1.A 36.58,59.69 v36.32,59.94
  Bottom 0.254: IMD_LATCH_SSR.2 v36.32,59.94
N$3
  Top 0.254: R1.1 96.02,23.38 96.93,24.28 97.87,24.28 98.04,24.45 98.04,26.29 97.79,26.54 96.01,26.54 94.74,25.27 U$9.7
N$4  (via drill 0.35)
  Top 0.254: C12.2 58.94,42.16 v59.94,41.15 59.94,40.89 v61.21,39.62
  Bottom 0.254: U$27.1 59.56,41.53 v59.94,41.15 | U$27.6 62.1,38.73 v61.21,39.62
N$5
  Bottom 0.254: IMD_LATCH_SSR.1 37.63,57.41 R12.1
N$6  (via drill 0.35)
  Top 0.254: U$10.7 100.84,61.02 100.84,63.75 v101.09,64.01
  Bottom 0.254: v101.09,64.01 100.2,63.12 96.65,63.12 95.5,64.26 91.44,64.26 89.15,61.98 89.15,54.36 92.96,50.55 92.96,46.99 94.23,45.72 94.23,40.64 95,39.88 95,38.1 98.8,34.29 102.61,34.29 102.87,34.04 102.87,32 102.1,31.23 R3.1
N$7  (via drill 0.35)
  Top 0.254: R10.1 63.24,48.25 v63.25,48.26
  Bottom 0.254: Q10.1 60.63,47.24 62.48,47.24 63.25,48.01 v63.25,48.26
N$8
  Top 0.254: C8.1 87.63,29.97 90.42,27.18 90.42,25.91 92.33,24 U$9.6
N$9  (via drill 0.35 pad 0.55)
  Top 0.254: LED3.A 30.48,57.15 28.96,58.67 28.96,63.25 v28.7,63.5
  Bottom 0.254: BMS_SSR.2 26.67,71.83 26.67,65.53 v28.7,63.5
N$10
  Bottom 0.254: D1.C 28.96,50.15 30.23,48.88 R5.1
N$11
  Bottom 0.254: D2.C R7.1
N$12
  Bottom 0.254: R13.2 38.15,70.67 BMS_LATCH_SSR.1
N$13
  Bottom 0.254: U$2.D4(CANRX) 105.41,19.05 104.39,20.07 104.39,24.06 CAN_TRANSCEIVER.4
N$14
  Bottom 0.254: CAN_TRANSCEIVER.1 103.76,29.34 104.65,28.45 104.65,26.92 106.93,24.64 108.46,24.64 109.47,23.62 109.47,19.81 U$2.D3(CANTX)
N$15
  Bottom 0.254: CAN_TRANSCEIVER1.4 27.12,17.84 22.61,22.35 U$1.D4(CANRX)
N$16  (via drill 0.35 pad 0.55)
  Top 0.254: LED2.A 38.1,60.2 34.29,64.01 v33.02,64.01
  Bottom 0.254: BMS_LATCH_SSR.2 36.88,74.93 33.02,74.93 32,73.91 32,72.14 33.02,71.12 v33.02,64.01
N$17
  Bottom 0.254: Q10.3 59.18,51.05 R48.2 60.46,51.82 R49.1
N$18
  Bottom 0.254: R11.1 28.44,69.6 28.44,70.67 BMS_SSR.1
N$19  (via drill 0.35 pad 0.55)
  Top 0.254: LED5.A v32.77,53.34
  Bottom 0.254: R14.2 32.77,54.11 v32.77,53.34
N$21  (via drill 0.35)
  Top 0.254: v57.15,39.88 55.37,41.66 C3.1
  Bottom 0.254: U$27.8 57.47,39.88 v57.15,39.88
N$22
  Bottom 0.254: CAN_TRANSCEIVER1.1 26.29,12.57 21.46,17.4 21.46,18.6 21.44,18.63 21.44,18.69 20.32,19.81 U$1.D3(CANTX)
N$23  (via drill 0.35)
  Top 0.254: U$24.1 U$24.2 60.33,51.1 56.39,47.16 v56.39,45.97
  Bottom 0.254: U$28.2 55.87,44.25 56.39,44.25 56.56,44.41 56.56,45.25 56.39,45.42 v56.39,45.97
N$24  (via drill 0.35)
  Top 0.254: v59.69,44.7 59.05,45.34 59.05,46.23 | 59.05,46.23 U$24.6 | U$24.7 60.13,46.23 59.05,46.23
  Bottom 0.254: U$27.2 60.83,43.56 v59.69,44.7
N$25  (via drill 0.35)
  Top 0.254: U$23.6 56.39,59.75 | 56.39,59.75 56.39,56.64 55.88,56.13 53.59,56.13 53.59,51.56 v52.83,50.8 | 56.39,59.75 U$23.7
  Bottom 0.254: U$26.2 54.8,50.8 v52.83,50.8
N$26
  Bottom 0.254: U$8.1 17.53,50.15 D4.C 13.32,54.36 INVERTER_SSR.3
N$27
  Bottom 0.254: INVERTER_SSR.2 6.13,55.38 R16.1
N$28  (via drill 0.35)
  Top 0.254: v6.1,53.09 14.22,53.09 16.26,55.12 21.59,55.12 22.86,53.85 22.86,51.85 LED6.A
  Bottom 0.254: R16.2 4.82,53.09 v6.1,53.09
N$29
  Top 0.254: R20.2 63.76,32.49 LED8.A
N$30
  Bottom 0.254: R36.2 71.55,69.94 Q2.1
N$31
  Bottom 0.254: IMD_SSR.1 27.69,57.36 R21.2
N$32  (via drill 0.35)
  Top 0.254: v21.84,58.42 25.91,58.42 28.96,55.37 LED7.A
  Bottom 0.254: R17.2 v21.84,58.42
N$33
  Bottom 0.254: D3.C 19.8,67.31 R15.1
N$34  (via drill 0.35)
  Top 0.254: v30.48,59.69 34.29,55.88 LED9.A
  Bottom 0.254: IMD_SSR.2 27.99,59.69 v30.48,59.69
N$35
  Top 0.254: LED14.C R45.2
N$36  (via drill 0.35)
  Top 0.254: v53.09,44.96 53.08,44.97 | 53.08,44.97 C16.2 | 53.08,44.97 53.08,41.16 v53.34,40.89
  Bottom 0.254: U$28.1 55.05,44.96 v53.09,44.96 | v53.34,40.89 52.9,40.89 51.5,42.29 U$28.6
N$37
  Bottom 0.254: C19.2 54.92,53.02 U$26.1 54.48,52.2 53.85,51.56 48.26,51.56 48.01,51.31 48.01,50.29 48.64,49.66 U$26.6
N$38  (via drill 0.35)
  Top 0.254: v51.31,46.23 51.31,48.76 C14.1
  Bottom 0.254: v51.31,46.23 51.31,46.16 U$28.8
N$40  (via drill 0.35 pad 0.55)
  Top 0.254: v16.51,56.13 21.59,56.13 23.36,54.36 23.36,53.35 25.15,51.56 LED18.A
  Bottom 0.254: R31.2 15.76,56.13 v16.51,56.13
N$41
  Bottom 0.254: U$26.8 50.67,52.2 52.07,53.59 52.07,55.63 52.32,55.88 C17.1
N$42
  Bottom 0.254: Q2.3 76.19,71.89 R37.1
N$43
  Bottom 0.254: R26.1 12.19,69.9 U$5.3 15.12,71.12 D10.C 15.24,73.56 SOFTWARE_SHUTOFF.2
N$44
  Bottom 0.254: R25.2 10.41,68.12 U$5.2
N$45
  Top 0.254: LED11.C R30.2
N$46  (via drill 0.35 pad 0.55)
  Top 0.254: v20.83,57.4 21.08,57.66 25.91,57.66 26.92,56.64 LED17.A
  Bottom 0.254: R26.2 16.5,60.45 19.56,60.45 20.83,59.18 v20.83,57.4
N$47  (via drill 0.35)
  Top 0.254: LED11.A 22.61,7.62 24.13,6.1 v24.38,6.1
  Bottom 0.254: U$3.6 37.6,5.33 25.15,5.33 v24.38,6.1
N$48  (via drill 0.35)
  Top 0.254: v99.69,63.88 99.95,63.63 U$10.6
  Bottom 0.254: v99.69,63.88 99.2,63.88 C7.1
N$49
  Top 0.254: U$3.15 35.69,32.64 LED10.A
N$50
  Top 0.254: LED10.C R32.2
N$51
  Bottom 0.254: R35.2 77.96,77.1 Q1.1
N$52
  Bottom 0.254: R38.2 64.01,71.7 Q3.1
N$53
  Bottom 0.254: R39.2 62.23,70.51 Q4.1
N$54
  Top 0.254: R40.2 75.68,77.72 78.13,77.72 Q5.1
N$55
  Top 0.254: Q6.1 72.75,69.85 R41.2
N$56
  Top 0.254: R42.2 64.77,71.12 66.21,69.68 Q7.1
N$57
  Top 0.254: R44.2 57.33,65.7 59.96,65.7 Q8.1
N$58
  Bottom 0.254: R49.2 62.49,49.28 62.99,49.28 62.99,51.31 60.88,53.42 58.44,53.42 U$15.1
N$59
  Bottom 0.254: Q1.3 78.87,75.07 R43.1
N$60  (1 unrouted)
  Top 0.254: U$16.+_1 68.83,13.21 U$2.3.3V_2
N$61
  Top 0.254: U$16.- U$2.GND_2
N$62
  Top 0.254: U$2.A15 63.88,4.7 CAN_TRANSCEIVER2.4
N$63
  Top 0.254: U$3.20 24.88,29.03 LED14.A
N$64
  Top 0.254: U$2.A14 60.07,3.43 CAN_TRANSCEIVER2.1
OKHS  (via drill 0.35)
  Top 0.254: v46.74,56.9 48.77,58.93 52.58,58.93 54.51,57 55.39,57 55.78,57.39 55.78,57.93 55.17,58.53 55.17,60.97 55.4,61.19 59.84,61.19 62.86,58.17 64.01,58.17 64.52,57.66 65.5,57.66 65.53,57.68 66.06,57.68 66.64,58.26 X1.P$33
  Bottom 0.254: R21.1 27.69,53.59 | 27.69,53.59 27.69,52.97 D1.A 31.81,51.95 32.26,52.41 37.44,52.41 37.89,51.95 40.02,51.95 41.4,53.34 46.48,53.34 46.74,53.59 v46.74,56.9 | R18.1 26.68,53.59 27.69,53.59
OKHS_READ  (via drill 0.35 pad 0.55)
  Top 0.254: U$18.7 38.73,45.34 v39.12,45.72
  Bottom 0.254: R5.2 R6.1 32.01,46.74 38.1,46.74 v39.12,45.72
PUMP1-
  Top 2.032: X2.P$2 97.04,41.66 U$6.2
PUMPCONTROL  (via drill 0.35)
  Top 0.254: U$6.1 100.58,38.1 100.58,33.53 100.59,33.52 | 100.59,33.52 106.93,27.18 106.93,17.02 103.63,13.72 v78.99,13.72 | R27.2 100.59,33.52
  Bottom 0.254: U$1.A6 1.27,22.61 1.27,8.59 2.29,7.57 23.06,7.57 24.64,9.14 74.93,9.14 78.99,13.21 v78.99,13.72
READ_ACCEL1  (via drill 0.35)
  Top 0.254: U$18.2 45.09,42.16 50.93,36.32 61.47,36.32 v61.98,35.81
  Bottom 0.254: U$27.5 63.37,36.7 62.48,35.81 v61.98,35.81
READ_ACCEL2  (via drill 0.35)
  Top 0.254: v43.94,41.15 43.94,43.31 U$18.3
  Bottom 0.254: v43.94,41.15 49.85,41.15 U$28.5
READ_BRAKE  (via drill 0.35)
  Top 0.254: v46.97,46.23 46.97,44.05 U$18.1
  Bottom 0.254: U$26.5 47.56,46.23 v46.97,46.23
SCK_TEENSY  (via drill 0.35)
  Top 0.254: v56.47,69.77 53.34,66.64 v53.34,66.29 | v55.12,38.86 54.1,39.88 53.34,39.88 52.58,40.64 52.58,44.2 51.2,45.57 51.04,45.57 49.78,46.82 49.78,50.55 53.09,53.85 53.09,56.39 v51.56,57.91 | U$18.13 42.55,36.45 43.69,35.31 v43.69,34.04
  Bottom 0.254: U$1.D13 11.3,42.67 17.65,36.32 25.4,36.32 27.69,34.04 v43.69,34.04 47.75,34.04 50.8,37.08 53.34,37.08 v55.12,38.86 | U$17.12 56.52,69.72 v56.47,69.77 | v51.56,57.91 52.83,59.18 52.83,65.79 v53.34,66.29
SCL
  Bottom 0.254: R34.1 102.62,5.33 U$2.A5 100.33,2.03 101.09,1.27 118.87,1.27 119.38,1.78 119.38,21.34 ADXL345_BREAKOUT.9
SDA  (via drill 0.35)
  Top 0.254: v106.17,9.4 112.52,15.75 113.28,15.75 114.3,16.76 114.3,20.07 115.82,21.59 ADXL345_BREAKOUT.8
  Bottom 0.254: U$2.A4 102.36,7.62 R33.1 106.17,7.88 v106.17,9.4
SHUTDOWN_A
  Top 1.016: 5ASHUTDOWNFUSE.R1 5ASHUTDOWNFUSE.R2 66.29,37.34 65.53,37.34 52.05,37.34 50.28,39.1 50.28,41.9 48.01,44.17 48.01,52.32 45.34,54.99 IMD_SHUTDOWN.6
SHUTDOWN_B
  Bottom 1.016: IMD_SHUTDOWN1.6 47.88,65.23 47.88,54.99 IMD_SHUTDOWN.5
SHUTDOWN_C
  Top 1.016: IMD_SHUTDOWN1.5 46.99,71.12 20.9,71.12 SOFTWARE_SHUTOFF.P
  Bottom 0.254: D3.A 18.91,69.85 SOFTWARE_SHUTOFF.P
SHUTDOWN_D
  Top 1.016: SOFTWARE_SHUTOFF.S 8.53,72.64 49.28,72.64 51.82,70.1 51.82,66.04 54.23,63.63 64.79,63.63 X1.P$5
  Bottom 0.254: SOFTWARE_SHUTOFF.S 5.33,67.82 11.42,61.73 11.42,58.42 R31.1
SHUTDOWN_OUT_READ  (via drill 0.35)
  Top 0.254: v40.74,48.13 41.27,47.6 U$18.5
  Bottom 0.254: v40.74,48.13 38.97,48.13 38.59,47.75 22.2,47.75 21.44,48.51 21.44,51.05 22.71,52.32 22.71,62.99 23.24,63.52 23.24,64.65 R22.1 23.11,65.53 20.07,65.53 R15.2
SIGNAL_ACCEL1  (via drill 0.35)
  Top 0.254: 63.75,51.05 v63.75,51.56 63.75,52.68 66.11,55.03 X1.P$25 | 63.75,51.05 61.72,49.02 59.18,49.02 57.78,47.62 U$24.5 | ACC1_PU.1 64.02,51.05 63.75,51.05
  Bottom 0.254: ACC1_PD.1 63.75,49.01 v63.75,51.56
SIGNAL_ACCEL2  (via drill 0.35)
  Top 0.254: X1.P$24 64.36,56.65 63.78,56.06 62.55,56.06 61.98,56.64 | v61.21,57.4 61.98,56.64 | 61.98,56.64 60.96,56.64 59.05,54.74 U$24.3
  Bottom 0.254: v61.21,57.4 60.97,57.65 ACC2_PD.1 ACC2_PU.1
SIGNAL_BRAKE
  Top 0.254: U$23.5 58.55,59.5 60.19,59.5 62.59,57.1 X1.P$8
SOFTWARE_SHUTDOWN  (via drill 0.35 pad 0.55)
  Top 0.254: v7.11,67.56 6.35,66.8 4.83,66.8 2.54,64.52 2.54,45.97 1.78,45.21 1.78,24.13 U$1.A7
  Bottom 0.254: U$5.1 7.11,68.28 v7.11,67.56
TELEMETRY5V  (via drill 0.35)
  Top 0.254: C5.1 45.47,23.88 | C21.2 50.41,31.36 50.8,31.75 | U$2.VIN 114.3,6.86 74.94,6.86 74.74,6.66 68.52,6.66 67.56,7.62 62.74,7.62 62.74,6.16 CAN_TRANSCEIVER2.3 | v92.96,52.35 92.95,52.34 92.95,46.75 92.2,46 92.2,45.21 93.47,43.94 93.47,41.91 92.46,40.89 88.9,40.89 87.63,39.62 87.63,35.37 88.97,34.04 88.97,29.59 92.01,26.54 U$9.8 95.25,26.54 95.76,27.05 98.18,27.05 99.07,26.16 C9.1 100.33,25.4 v100.84,25.91 | v54.1,21.08 53.34,21.84 v53.34,24.89 | v101.85,62.48 102.49,61.85 U$10.8
  Top 1.016: REG1.3 41.67,21.6 43.94,23.88 45.47,23.88 45.97,23.88 50.8,28.7 50.8,31.75 REG3.3
  Bottom 0.254: U$2.VIN 116.33,4.83 113.03,4.83 106.93,10.92 106.93,23.62 103.76,26.8 CAN_TRANSCEIVER.3 101.73,26.8 v100.84,25.91 100.84,25.15 99.85,24.16 98.04,24.16 | v54.1,21.08 54.1,20.57 93.98,20.57 97.56,24.16 98.04,24.16 | C10.1 101.85,66.05 101.85,63.63 | v53.34,24.89 50.8,27.43 REG3.3 | v92.96,52.35 92.99,52.35 96.27,55.63 96.27,58.05 101.85,63.63 | ADXL345_BREAKOUT.1 98.04,24.16 | v101.85,62.48 101.85,63.63
TELEMETRY_CANH
  Top 0.254: CAN_TRANSCEIVER2.7 61.34,13.33 R46.2 57.78,16.89 57.78,19.17 60.45,21.84 73.91,21.84 74.68,22.61 74.68,41.85 X4.P$4
TELEMETRY_CANL
  Top 0.254: CAN_TRANSCEIVER2.6 62.61,13.83 R46.1 62.48,14.23 62.48,15.24 61.47,16.26 59.44,16.26 58.42,17.27 58.42,19.24 60.62,21.44 74.27,21.44 75.44,22.61 75.44,40.11 X4.P$3
TEMPSENSE  (via drill 0.35)
  Top 0.254: BOARD_TEMP.2 93.97,37.86 R9.2 92.71,36.83 91.44,35.56 v88.65,35.56 | v34.8,36.45 41.02,30.23 v49.53,30.23 | U$18.8 37.59,43.31 v37.59,41.15 | v54.82,21.9 55.08,22.16 55.08,25.44 v54.86,25.65
  Bottom 0.254: v34.8,36.45 33.47,37.78 33.47,39.69 34.92,41.15 v37.59,41.15 | v54.86,25.65 54.86,25.4 53.53,24.07 53.15,24.07 49.53,27.69 v49.53,30.23 | v54.82,21.9 54.82,21.89 55.37,21.34 73.41,21.34 87.63,35.56 v88.65,35.56
VCC
  Top 0.254: C6.2 34.7,17.62 REG1.4
  Top 1.016: REG1.2 REG1.4 29.3,13.91 U$3.1
XB8
  Bottom 0.254: U$2.D7(RX3) 86.11,6.6 68.07,6.6 66.55,8.13 36.39,8.13 U$3.4
XBDI  (via drill 0.35)
  Top 0.254: v40.39,5.33 35,5.33 U$3.3 | v57.53,5.84 59.82,8.13 69.4,8.13 70.46,7.07 74.57,7.07 75.63,8.13 80.01,8.13 v80.52,8.64
  Bottom 0.254: U$2.D10(TX2) 86.36,14.48 85.09,14.48 80.77,10.16 80.77,9.14 80.52,8.89 v80.52,8.64 | v57.53,5.84 57.02,5.33 v40.39,5.33
XBDO
  Bottom 0.254: U$2.D9(RX2) 92.71,16.51 84.07,7.87 77.72,7.87 77.05,7.2 69.26,7.2 67.82,8.64 32.9,8.64 U$3.2

## Text on the board
tDocu: ↑FAN1 | ↓FAN2 | Inverter | Shutdown | Software | BMS Coil | BMS OK | IMD Coil | IMD OK | Latch / Button | ↑PUMP1 | Assoc | MQTT | HyTech 2019 Main ECU rev2 | Designed By Parker Jones